# EAGLE design 1DD-17-mk-1.2 (EAGLE 9.3.1)
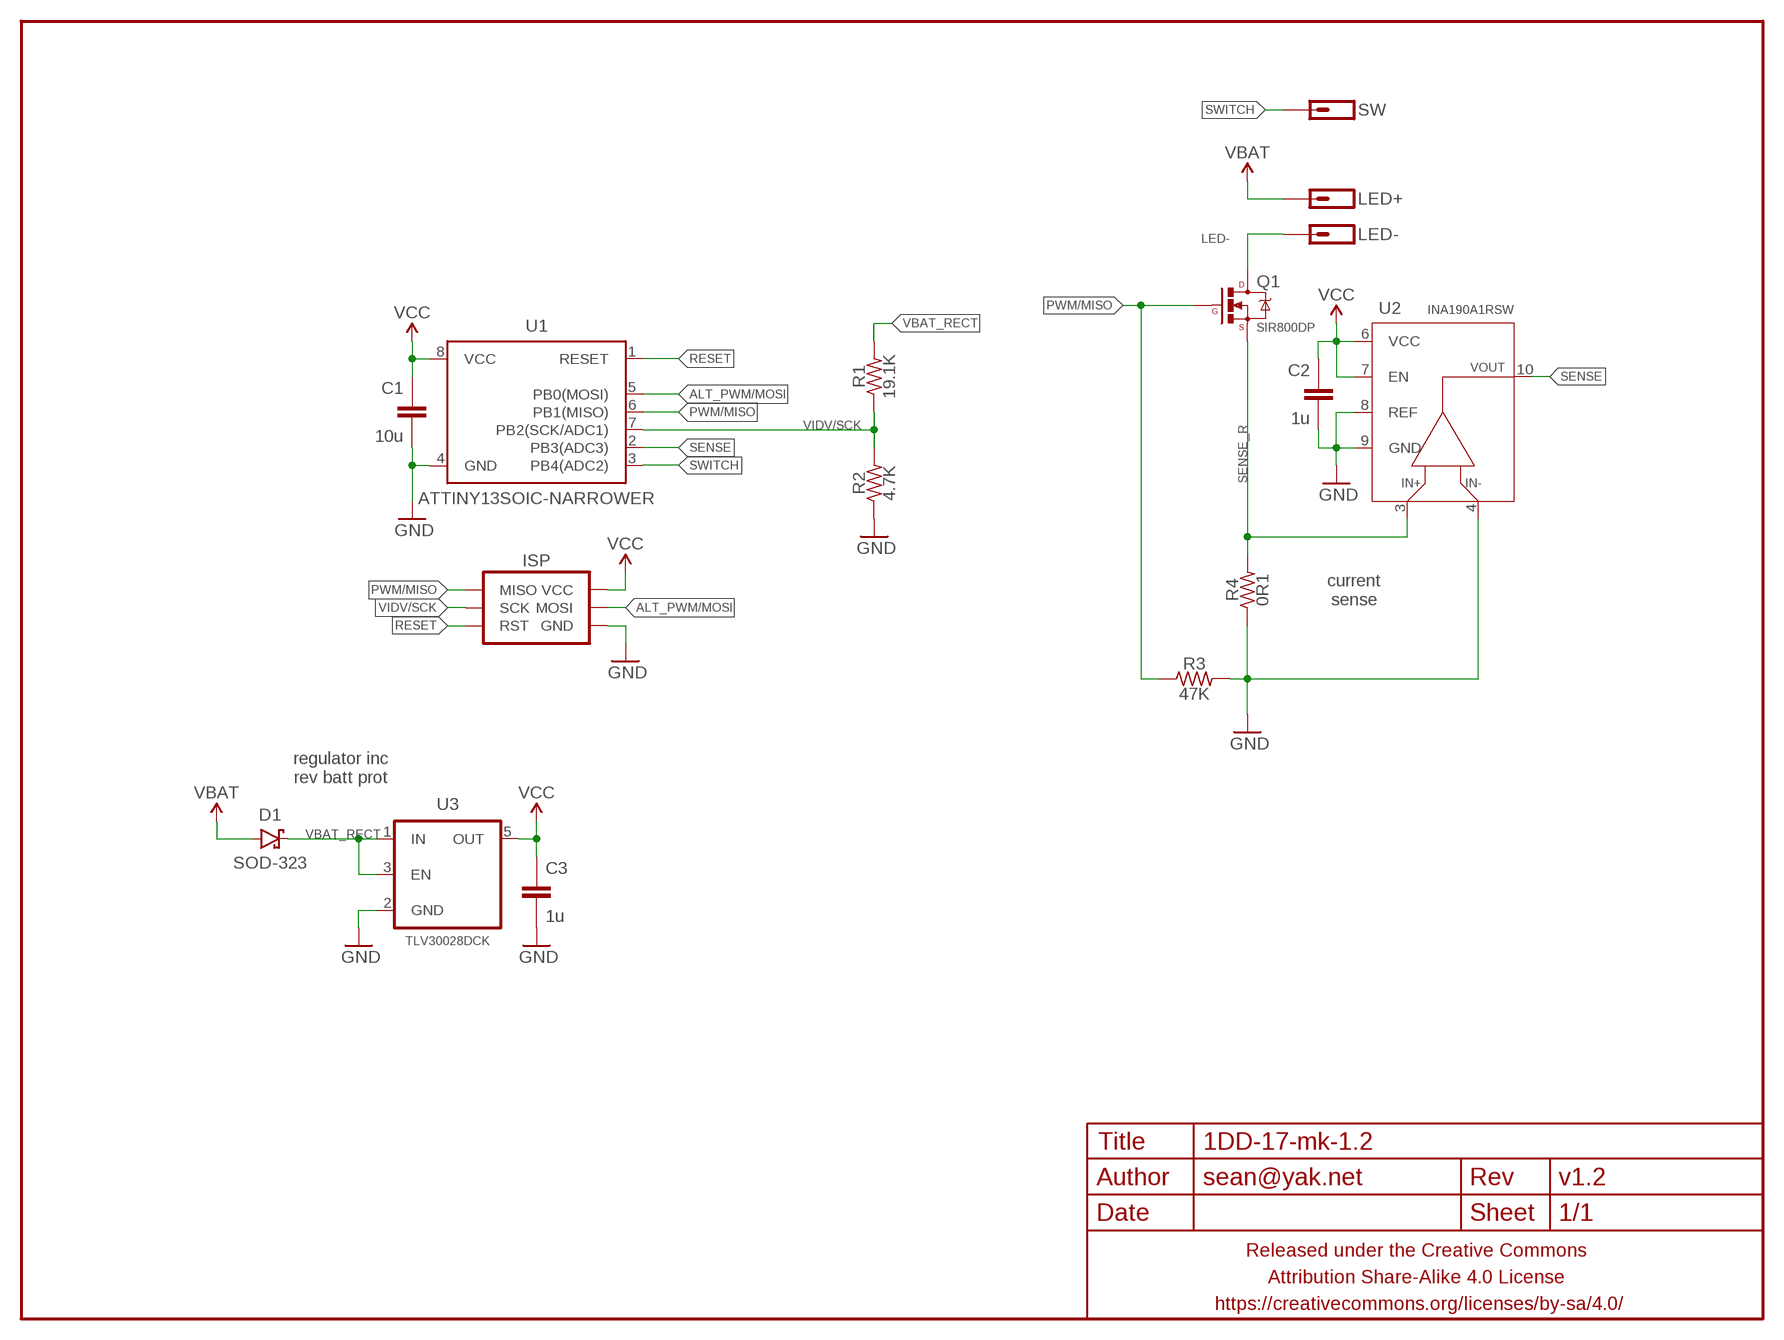
[diagram p0: schematic, sheet 1]

## Parts
C1  10u  CAPACITOR-CERAMICC0402  [C0402]
C2  1u  CAPACITOR-CERAMICC0402  [C0402]
C3  1u  CAPACITOR-CERAMICC0402  [C0402]
D1  SOD-323  DIODE-SCHOTTKYSOD323  [SOD323-SCHOTTKY]
FRAME1  FRAME-LETTERNO_PACKAGE  [DUMMY]
ISP  AVR_SPI_PRG_6SMD-1.27MM  [2X3-1.27MM-SMD]
LED+  M01PTH-0.9MM-CIR  [1X01-0.9MM-CIR]
LED-  M01PTH-0.9MM-CIR  [1X01-0.9MM-CIR]
Q1  SIR800DP  MOSFET-NCHANNELPSMN4R0-30YLD  [LFPAK56]
R1  19.1K  RESISTORR0402  [R0402]
R2  4.7K  RESISTORR0402  [R0402]
R3  47K  RESISTORR0402  [R0402]
R4  0R1  RESISTORR0805-TIGHTER  [R0805-TIGHTER]
SW  M01SMD-1MM-DIA-NS  [1X01-SMD-1MM-DIA-NS]
U1  ATTINY13SOIC-NARROWER  [SO08-SKINNYPADS]
U2  INA190A1RSW  INA190RSW  [UQFN-10]
U3  TLV30028DCK  V_REG_ENTLV700XXDCK-TIGHTER  [SC70-TIGHTER]

## Nets
ALT_PWM/MOSI: ISP.4(MOSI) U1.5(PB0(MOSI))
GND: C1.2 C2.2 C3.2 ISP.6(GND) R2.1 R3.2 R4.1 U1.4(GND) U2.4(VIN-) U2.8(REF) U2.9(GND) U3.2(GND)
LED-: LED-.P$1 Q1.PAD(D)
PWM/MISO: ISP.1(MISO) Q1.4(G) R3.1 U1.6(PB1(MISO))
RESET: ISP.5(RST) U1.1(RESET)
SENSE: U1.2(PB3(ADC3)) U2.10(OUT)
SENSE_R: Q1.1(S) Q1.2(S) Q1.3(S) R4.2 U2.3(VIN+)
SWITCH: SW.P$1 U1.3(PB4(ADC2))
VBAT: D1.A LED+.P$1
VBAT_RECT: D1.C R1.2 U3.1(IN) U3.3(EN)
VCC: C1.1 C2.1 C3.1 ISP.2(VCC) U1.8(VCC) U2.6(VCC) U2.7(EN) U3.5(OUT)
VIDV/SCK: ISP.3(SCK) R1.1 R2.2 U1.7(PB2(SCK/ADC1))

## Notes on the sheet
- current
  sense
- regulator inc
  rev batt prot

## Library data of the parts
C1-C3 = a_parts:CAPACITOR-CERAMIC: CAPACITOR, European symbol
D1 = a_parts:DIODE-SCHOTTKY: Schottky diodes in SFE's production catalog BAT20J 1A 23V 0.62Vf RB751 120mA 40V 0.37Vf PMEG4005EJ 0.5A 40V 0.42Vf MBRA140 1A 40V 0.5Vf B340A 3A 40V SMA
FRAME1 = a_parts:FRAME-LETTER: Schematic Frame Standard 8.5x11 US Letter frame; DESIGNER: sean@yak.net; VERSION: v1.2
ISP = a_parts:AVR_SPI_PRG_6: AVR ISP 6 Pin This is the reduced ISP connector for AVR programming. Common on Arduino. This footprint will take up less PCB space and can be used with a 10-pin to 6-pin adapter such as SKU: BOB-08508 **Special note about "TEST_POINT" package. The stop mask is on the top side, so if you want your programming test points to be on the bottom of your board, make sure to place this package on the bottom side of the board. This also ensure that the orientation to program from the bottom side will be correct.
LED+ LED- SW = a_parts:M01: Header 1 Standard 1-pin 0.1" header. Use with straight break away headers (SKU : PRT-00116), right angle break away headers (PRT-00553), swiss pins (PRT-00743), machine pins (PRT-00117), and female headers (PRT-00115).
Q1 = a_parts:MOSFET-NCHANNEL: Common NMOSFET Parts MFG P/N Store ID Prod ID FDD8780 TRANS-09984 SI7820DN TRANS-11055 FDS6630A IC-08089 2N7002PW TRANS-11151 FQP30N06L COM-10213 TRANS-10060 BSS123LT1G TRANS-08345 BSS138 TRANS-00830 BS170 2N7000
R1-R4 = a_parts:RESISTOR: RESISTOR, American symbol
U1 = a_parts:ATTINY13: Atmel 8-pin 1kB flash uC
U2 = a_parts:INA190
U3 = a_parts:V_REG_EN

## Board
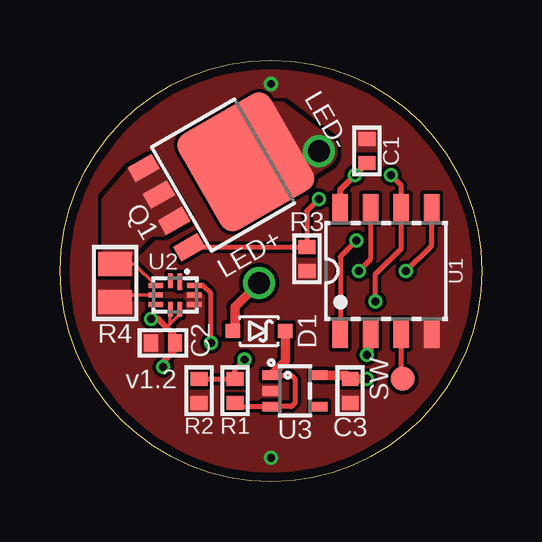
[diagram p1: board, top side]
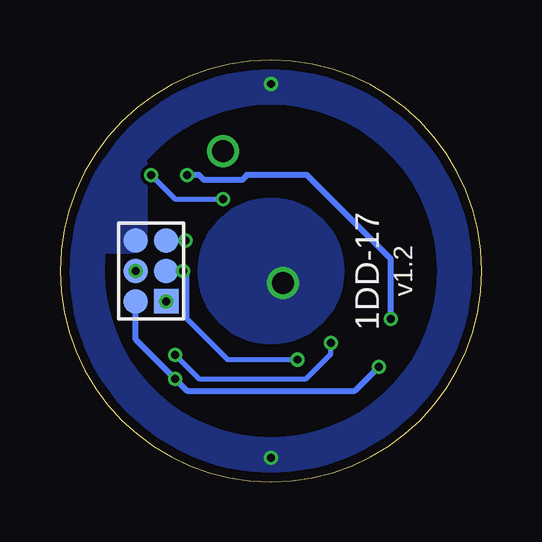
[diagram p2: board, bottom side, seen from below]

Size 17.6 x 17.6 mm. Coordinates in mm from the lower left corner, seen from the top.
Outline: 0,8.8 arc-180 17.6,8.8 arc-180 0,8.8
Copper layers (1*16): Top 0.035559375mm / dielectric 1.6mm / Bottom 0.035559375mm
Design rules "oshpark-2layer": minimum track width 6mil, minimum drill 10mil, track to track 6mil, track to pad 6mil, pad to pad 6mil, via to via 6mil, smd to smd 0mil, copper to edge 15mil, drill to drill 6mil, minimum pad ring 5mil, minimum via ring 5mil, stop-mask expansion 2.5mil, vias tented up to drill 20mil, thermal gap 10mil

### Footprints (pad centres in the part's own frame; a part is rotated, then mirrored left to right if it is on the bottom)
C0402 = smd 0.6 x 0.7: 1 -0.5,0; 2 0.5,0
SOD323-SCHOTTKY = smd 0.6 x 0.6: A -1.1,0; C 1.1,0
2X3-1.27MM-SMD = smd 1.016 x 1.016: 1 -1.27,-0.635; 2 -1.27,0.635; 3 0,-0.635; 4 0,0.635; 5 1.27,-0.635; 6 1.27,0.635
1X01-0.9MM-CIR = drill 0.9: P$1 0,0
LFPAK56 = smd 0.7 x 1.15: 1 -1.905,-2.725; 2 -0.635,-2.725; 3 0.635,-2.725; 4 1.905,-2.725 | smd 4.6 x 4.4: PAD 0,1.1
R0402 = smd 0.6 x 0.7: 1 -0.5,0; 2 0.5,0
R0805-TIGHTER = smd 1 x 1.4: 1 -0.8,0; 2 0.8,0
1X01-SMD-1MM-DIA-NS = smd 1 x 1: P$1 0,0
SO08-SKINNYPADS = smd 0.65 x 1.2: 1 -1.905,-2.6; 2 -0.635,-2.6; 3 0.635,-2.6; 4 1.905,-2.6; 5 1.905,2.6; 6 0.635,2.6; 7 -0.635,2.6; 8 -1.905,2.6
UQFN-10 = smd 0.2 x 0.7: 1 -0.2,-0.55 | smd 0.2 x 0.6: 2 0.2,-0.6; 6 0.2,0.6; 7 -0.2,0.6 | smd 0.6 x 0.2: 3 0.8,-0.4; 4 0.8,0; 5 0.8,0.4; 8 -0.8,0.4; 9 -0.8,0; 10 -0.8,-0.4
SC70-TIGHTER = smd 0.4 x 0.7: 1 -0.65,-1; 2 0,-1; 3 0.65,-1; 4 0.65,1; 5 -0.65,1

### Placement (x,y rotation side)
C1  12.8,13.8 90 top
C2  4.3,5.8 180 top
C3  12.1,3.8 270 top
D1  8.3,6.3 0 top
FRAME1  -0.2,-0.2 0 top
ISP  13.8,8.8 90 bottom
LED+  8.3,8.3 0 top
LED-  10.8,13.8 270 top
Q1  6.8,12.8 300 top
R1  7.3,3.8 270 top
R2  5.8,3.8 90 top
R3  10.3,9.3 270 top
R4  2.3,8.3 90 top
SW  14.3,4.3 90 top
U1  13.6,8.8 0 top
U2  4.8,7.8 180 top
U3  9.8,3.8 270 top

### Tracks (layer width: path | path; a pad name or v marks a point on that pad's centre or on a via)
ALT_PWM/MOSI  (via drill 0.33)
  Top 0.2: ISP.4 15.51,9.87 U1.5
  other vias: 14.44,8.8
GND  (via drill 0.33)
  Top 0.152: R4.1 2.6,7.8 U2.4
  other vias: 8.8,16.6 8.8,1
  pour Bottom (isolate 0.152, rank 6, no thermals): -0.2,8.8 1.8,8.8 arc90 8.8,1.8 arc90 15.8,8.8 17.8,8.8 17.8,-0.2 -0.2,-0.2
  pour Top (isolate 0.152, rank 6, no thermals): 17.8,-0.2 17.8,17.8 -0.2,17.8 -0.2,-0.2
  pour Bottom (isolate 0.152, rank 6, no thermals): 17.8,8.8 15.8,8.8 arc90 8.8,15.8 arc90 1.8,8.8 -0.2,8.8 -0.2,17.8 17.8,17.8
  cutout Top: 4.3,8.3 4.3,7.6 3,7.6 3,8.3
  pour Bottom (rank 6, no thermals): 17.3,9.6 14.64,9.6 arc-90 14,10.24 14,13.3 17.3,13.3
LED-
  pour Top (no thermals): 5.3,14.3 7.3,10.8 11.3,13.3 arc90 11.3,14.3 9.3,15.8 8.3,15.8
PWM/MISO  (via drill 0.33)
  Top 0.2: ISP.1 13.17,8.67 14.24,9.74 U1.6 14.24,12.37 v13.8,12.8 | Q1.4 10.29,9.79 R3.1 10.3,11.3 v10.8,11.8
  Bottom 0.2: v13.8,12.8 12.8,11.8 v10.8,11.8
  other vias: 13.17,7.53
RESET  (via drill 0.33)
  Top 0.2: v12.37,10.07 11.7,9.4 U1.1
  Bottom 0.2: ISP.5 v12.37,10.07
SENSE  (via drill 0.33)
  Top 0.2: U1.2 12.96,5.47 v12.8,5.3 | v6.3,5.8 6.3,7.86 5.96,8.2 U2.10
  Bottom 0.2: v12.8,5.3 11.8,4.3 7.33,4.3 6.3,5.33 v6.3,5.8
SENSE_R
  Top 0.152: R4.2 3.1,9.1 U2.3
  pour Top (no thermals): 2.9,13.1 1.8,11.8 1.8,8.8 2.8,8.8 2.8,9.3 3.8,10.3 4.3,10.3 5.4,10.9 3.8,13.6
SWITCH
  Top 0.2: SW.P$1 14.24,4.37 U1.3
VBAT
  Top 0.4: LED+.P$1 7.3,7.3 7.3,6.3 D1.A
  pour Bottom (isolate 0.152, no thermals): 5.8,8.8 arc-180 11.8,8.8 arc-180
VBAT_RECT
  Top 0.2: U3.1 9.65,4.45 9.8,4.3 9.8,3.3 9.65,3.15 U3.3 7.45,3.15 R1.2
  Top 0.4: D1.C 9.4,5.05 U3.1
VCC  (via drill 0.33)
  Top 0.152: U2.7 5,7 4.6,6.6 | 4.6,6.6 4.45,6.45 | U2.6 4.6,6.6
  Top 0.254: U1.8 11.7,12.2 v12.3,12.8 C1.1 | v3.8,6.8 4.1,6.8 4.45,6.45 4.8,6.1 C2.1 4.8,5.5 4.3,5 v4.3,4.8
  Top 0.4: U3.5 11.95,4.45 C3.1 v12.8,4.3
  Bottom 0.254: v4.3,4.8 5.3,3.8 12.3,3.8 v12.8,4.3 14.44,5.94 ISP.2 | v3.8,6.8 3.8,9.3 7.3,12.8 9.8,12.8 10,12.6 11.6,12.6 11.8,12.8 v12.3,12.8
VIDV/SCK  (via drill 0.33)
  Top 0.2: R2.2 R1.1 7.3,4.7 v7.7,5.1 | v12.46,8.8 12.96,9.3 U1.7
  Bottom 0.2: v7.7,5.1 10.6,5.1 12.3,6.8 12.3,8.64 v12.46,8.8 ISP.3

### Text on the board
bPlace: 1DD-17